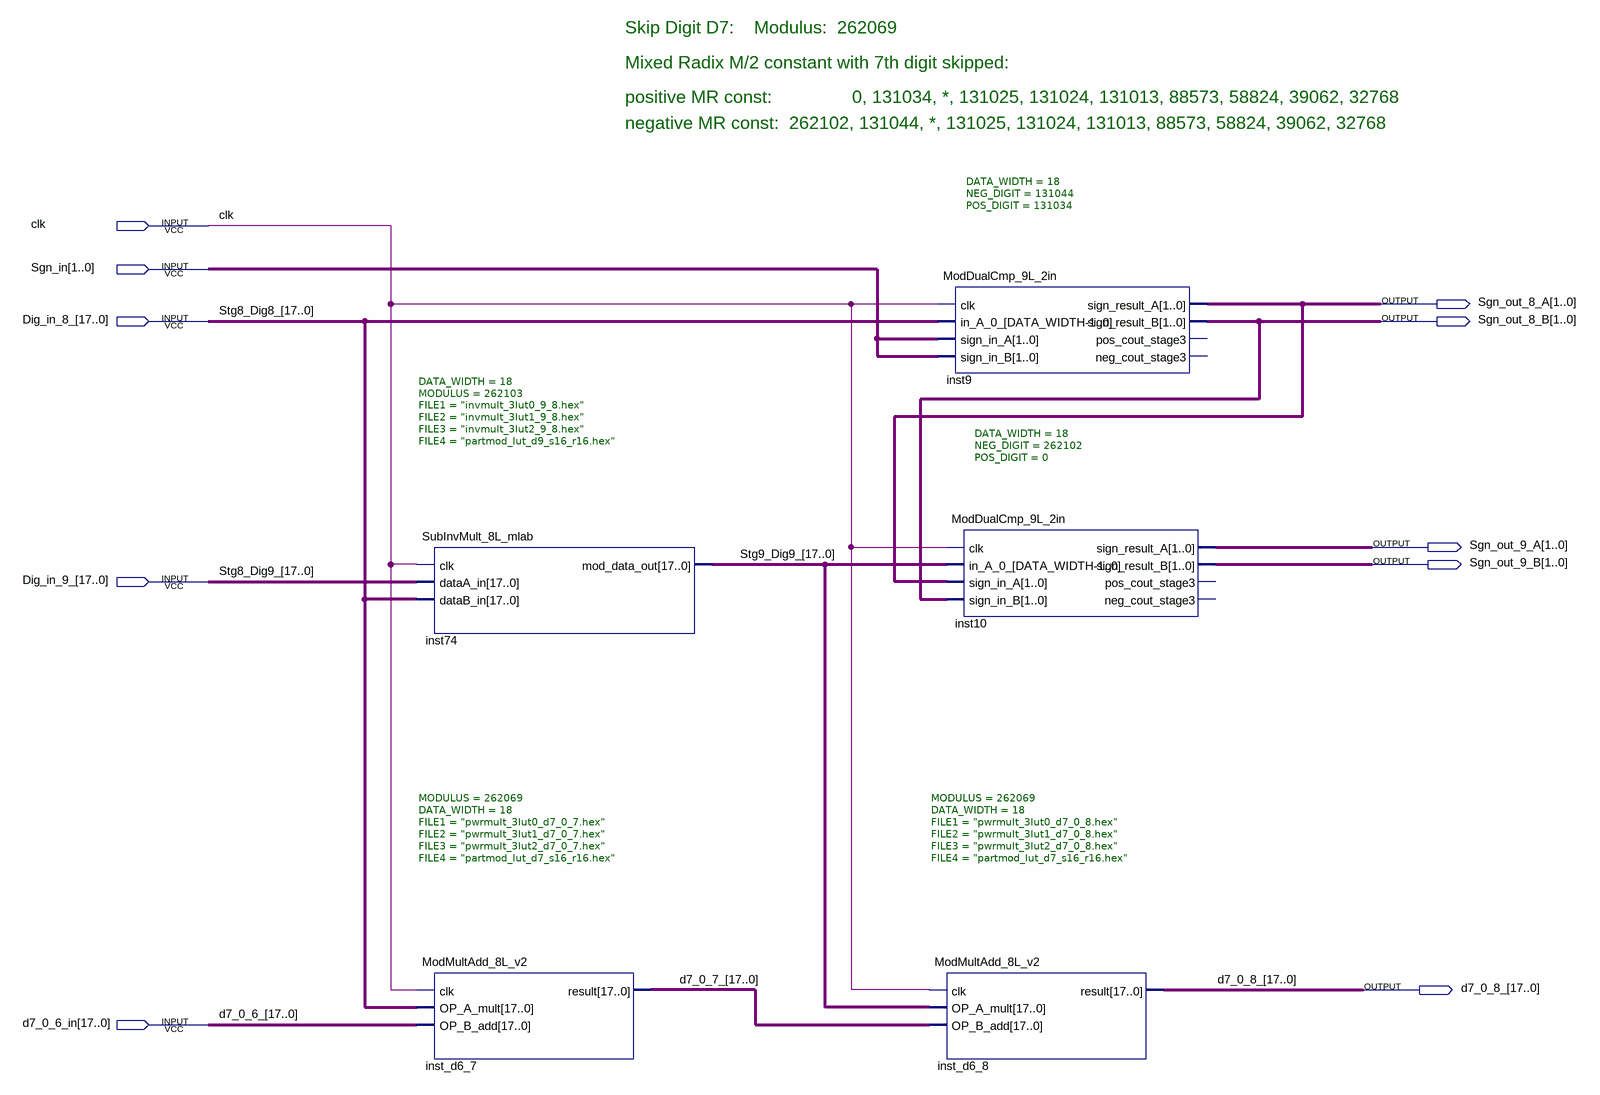
[diagram p0: schematic sheet]
// Quartus schematic MRC_pipe_mlab_ec_skp7.bdf as structural Verilog: 5 symbols, 10 pins
module MRC_pipe_mlab_ec_skp7 (
  input  clk,
  input  [1:0] Sgn_in,
  input  [17:0] Dig_in_8_,
  input  [17:0] Dig_in_9_,
  input  [17:0] d7_0_6_in,
  output [1:0] Sgn_out_8_A,
  output [1:0] Sgn_out_8_B,
  output [1:0] Sgn_out_9_A,
  output [1:0] Sgn_out_9_B,
  output [17:0] d7_0_8_
);

  wire [17:0] d7_0_7_, Stg9_Dig9_;

  SubInvMult_8L_mlab #(.DATA_WIDTH(18), .MODULUS(262103), .FILE1("invmult_3lut0_9_8.hex"), .FILE2("invmult_3lut1_9_8.hex"), .FILE3("invmult_3lut2_9_8.hex"), .FILE4("partmod_lut_d9_s16_r16.hex")) inst74 (
    .clk(clk), .dataA_in(Dig_in_9_), .dataB_in(Dig_in_8_), .mod_data_out(Stg9_Dig9_));
  ModMultAdd_8L_v2 #(.MODULUS(262069), .DATA_WIDTH(18), .FILE1("pwrmult_3lut0_d7_0_7.hex"), .FILE2("pwrmult_3lut1_d7_0_7.hex"), .FILE3("pwrmult_3lut2_d7_0_7.hex"), .FILE4("partmod_lut_d7_s16_r16.hex")) inst_d6_7 (
    .clk(clk), .OP_A_mult(Dig_in_8_), .OP_B_add(d7_0_6_in), .result(d7_0_7_));
  ModDualCmp_9L_2in #(.DATA_WIDTH(18), .NEG_DIGIT(131044), .POS_DIGIT(131034)) inst9 (
    .clk(clk), .in_A_0_(Dig_in_8_), .sign_in_A(Sgn_in), .sign_in_B(Sgn_in), .sign_result_A(Sgn_out_8_A),
    .sign_result_B(Sgn_out_8_B));  // open: pos_cout_stage3, neg_cout_stage3
  ModMultAdd_8L_v2 #(.MODULUS(262069), .DATA_WIDTH(18), .FILE1("pwrmult_3lut0_d7_0_8.hex"), .FILE2("pwrmult_3lut1_d7_0_8.hex"), .FILE3("pwrmult_3lut2_d7_0_8.hex"), .FILE4("partmod_lut_d7_s16_r16.hex")) inst_d6_8 (
    .clk(clk), .OP_A_mult(Stg9_Dig9_), .OP_B_add(d7_0_7_), .result(d7_0_8_));
  ModDualCmp_9L_2in #(.DATA_WIDTH(18), .NEG_DIGIT(262102), .POS_DIGIT(0)) inst10 (
    .clk(clk), .in_A_0_(Stg9_Dig9_), .sign_in_A(Sgn_out_8_A), .sign_in_B(Sgn_out_8_B),
    .sign_result_A(Sgn_out_9_A), .sign_result_B(Sgn_out_9_B));  // open: pos_cout_stage3, neg_cout_stage3

  // Other names for the same wires on the sheet: d7_0_6_[17:0] = d7_0_6_in; Stg8_Dig8_[17:0] = Dig_in_8_;
  //   Stg8_Dig9_[17:0] = Dig_in_9_

  // Notes on the sheet:
  //   Skip Digit D7:    Modulus:  262069  
  //   Mixed Radix M/2 constant with 7th digit skipped:
  //   positive MR const:                0, 131034, *, 131025, 131024, 131013, 88573, 58824, 39062, 32768
  //   negative MR const:  262102, 131044, *, 131025, 131024, 131013, 88573, 58824, 39062, 32768
endmodule
